# Altium schematic sheet Power_part.SchDoc
size A4; SheetNumber: 3; SheetTotal: 3
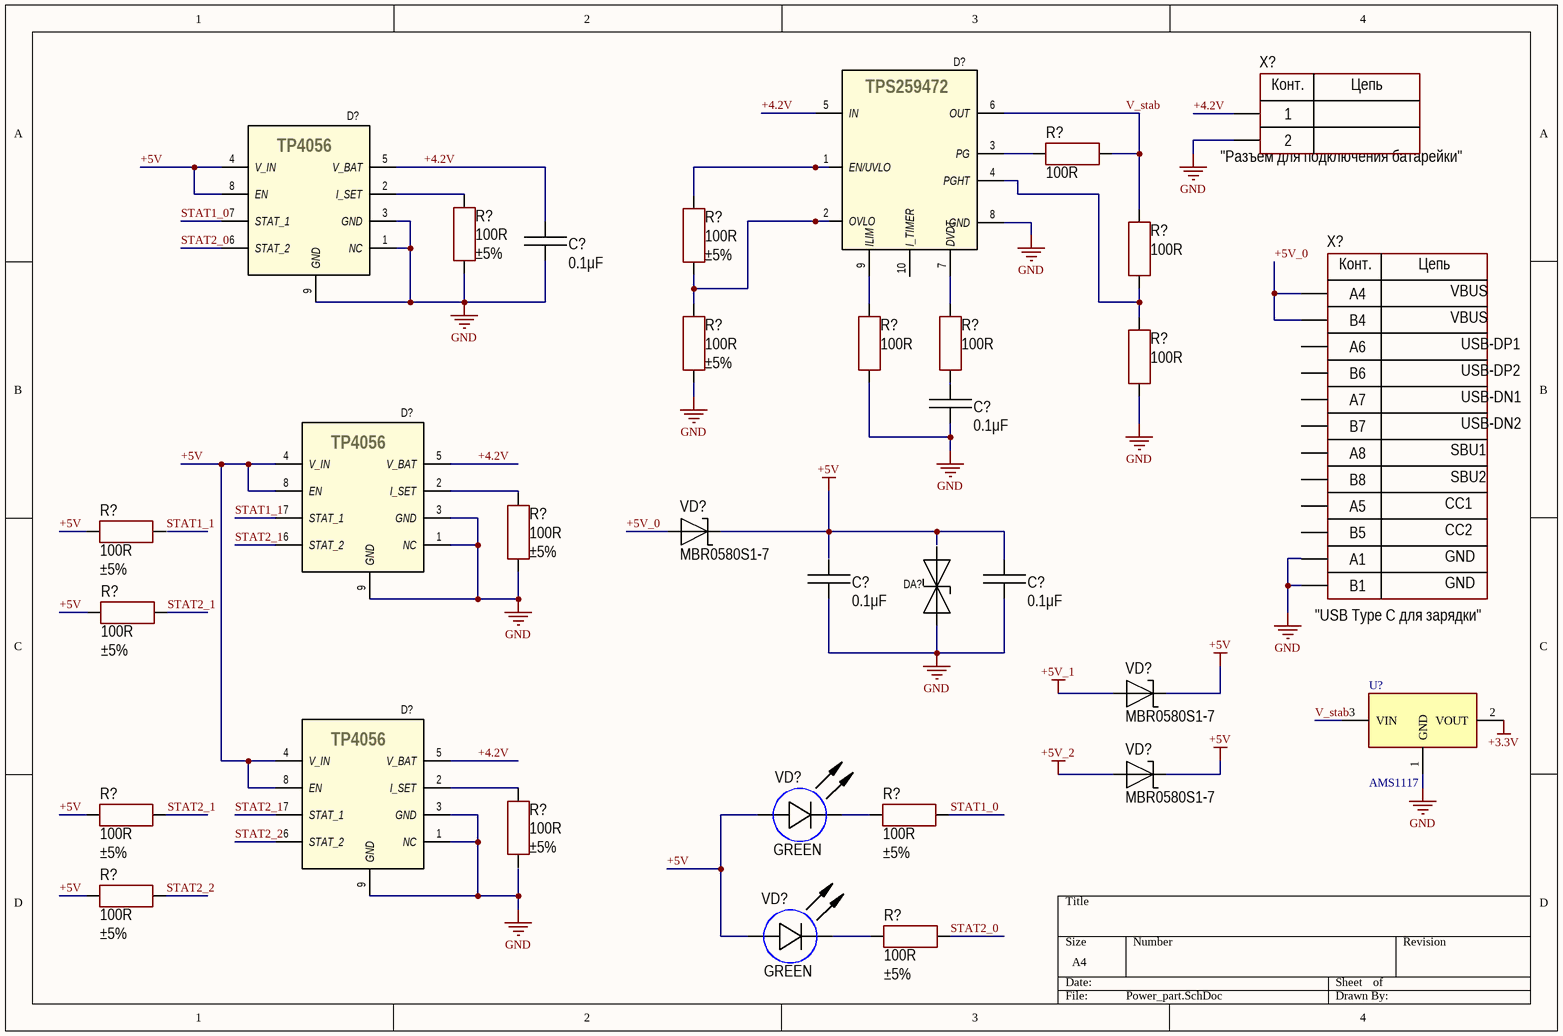
[diagram p0: Power_part.SchDoc]

## Parts
(Parts that share a designator on the sheet are numbered #1, #2 ... from top to bottom, then left to right.)
C?#1  value 0.1μF  [CAP: 0603]
C?#2  value 0.1μF  [CAP: 0603]
C?#3  value 0.1μF  [CAP: 0603]
C?#4  value 0.1μF  [CAP: 0603]
D?#1  Texas Instruments  [TPS259472ARPWR]  (value not drawn)
D?#2  UTD Semiconductor Co.,Ltd  [TP4056]  (value not drawn)
D?#3  UTD Semiconductor Co.,Ltd  [TP4056]  (value not drawn)
D?#4  UTD Semiconductor Co.,Ltd  [TP4056]  (value not drawn)
DA?  Littelfuse  [SMAJ12CA]  (value not drawn)
R?#1  value 100R  [RES: 0603]
R?#2  value 100R  Tolerance: ±5%  [RES: 0603]
R?#3  value 100R  Tolerance: ±5%  [RES: 0603]
R?#4  value 100R  [RES: 0603]
R?#5  value 100R  Tolerance: ±5%  [RES: 0603]
R?#6  value 100R  [RES: 0603]
R?#7  value 100R  [RES: 0603]
R?#8  value 100R  [RES: 0603]
R?#9  value 100R  Tolerance: ±5%  [RES: 0603]
R?#10  value 100R  Tolerance: ±5%  [RES: 0603]
R?#11  value 100R  Tolerance: ±5%  [RES: 0603]
R?#12  value 100R  Tolerance: ±5%  [RES: 0603]
R?#13  value 100R  Tolerance: ±5%  [RES: 0603]
R?#14  value 100R  Tolerance: ±5%  [RES: 0603]
R?#15  value 100R  Tolerance: ±5%  [RES: 0603]
R?#16  value 100R  Tolerance: ±5%  [RES: 0603]
U?  AMS1117  [AMS1117]
VD?#1  PartNumber: MBR0580S1-7  [DIODE: SMA]
VD?#2  PartNumber: MBR0580S1-7  [DIODE: SMA]
VD?#3  PartNumber: MBR0580S1-7  [DIODE: SMA]
VD?#4  Color: GREEN  [LED: 0402B]
VD?#5  Color: GREEN  [LED: 0402B]
X?#1  CommentText: "Разъем для подключения батарейки"  [CON: PLS-2]
X?#2  CommentText: "USB Type C для зарядки"  [CON: TYPE-C-31-M-12]

## Nets
+3.3V: U?.2(VOUT)
+5V: C?#4.2 D?#2.4(V_IN) D?#2.8(EN) D?#3.4(V_IN) D?#3.8(EN) D?#4.4(V_IN) D?#4.8(EN) R?#9.1 R?#11.1 R?#12.1 R?#15.2 VD?#1.2 VD?#2.2 VD?#3.2 VD?#4.1(A) VD?#5.1(A)
+5V_1: VD?#2.1
+5V_2: VD?#3.1
GND: C?#1.2 C?#2.1 C?#3.1 C?#4.1 D?#1.8(GND) D?#2.1(NC) D?#2.3(GND) D?#2.9(GND) D?#3.1(NC) D?#3.3(GND) D?#3.9(GND) D?#4.1(NC) D?#4.3(GND) D?#4.9(GND) DA?.2 R?#2.1 R?#5.1 R?#6.1 R?#8.1 R?#10.1 U?.1(GND) X?#1.2 X?#2.A1 X?#2.B1
+4.2V: C?#1.1 D?#1.5(IN) D?#2.5(V_BAT) D?#3.5(V_BAT) D?#4.5(V_BAT) X?#1.1
+5V_0: VD?#1.1 X?#2.A4 X?#2.B4
STAT1_0: D?#2.7(STAT_1) R?#13.2
STAT1_1: D?#3.7(STAT_1) R?#9.2
STAT2_0: D?#2.6(STAT_2) R?#16.2
STAT2_1: D?#3.6(STAT_2) D?#4.7(STAT_1) R?#11.2 R?#12.2
STAT2_2: D?#4.6(STAT_2) R?#15.1
V_stab: D?#1.6(OUT) R?#1.1 R?#4.2 U?.3(VIN)
NetC?#2_2: C?#2.2 R?#7.1
NetD?#1_1: D?#1.1(EN/UVLO) R?#3.2
NetD?#1_2: D?#1.2(OVLO) R?#3.1 R?#5.2
NetD?#1_3: D?#1.3(PG) R?#1.2
NetD?#1_4: D?#1.4(PGHT) R?#4.1 R?#8.2
NetD?#1_7: D?#1.7(DVDT) R?#7.2
NetD?#1_9: D?#1.9(ILIM) R?#6.2
NetD?#2_2: D?#2.2(I_SET) R?#2.2
NetD?#3_2: D?#3.2(I_SET) R?#10.2
NetD?#4_2: D?#4.2(I_SET) R?#14.2
NetR?#13_1: R?#13.1 VD?#4.2(C)
NetR?#16_1: R?#16.1 VD?#5.2(C)

Not connected (* = marked no-connect by the designer): C?#3 2; D?#1 10(I_TIMER); DA? 1; R?#14 1; X?#2 A5 A6 A7 A8 B5 B6 B7 B8

## Notes on the sheet
- (in symbol Connector_USB_Type_C) Конт.; Цепь; VBUS; USB-DP1; USB-DP2; USB-DN1; USB-DN2; SBU1; SBU2; CC1; CC2; GND
- (in symbol PLS-2) Конт.; Цепь
- (in symbol TPS259472ARPWR) TPS259472

## Library data of the parts
C?#1-C?#4 = Ceramic_0603: Manufacturer: Yageo; PartNumber: CC0603KRX7R7BB104; ValueManufacturerPartNumber: Ceramic capacitor, 0.1μF, X7R, ±10%, 16V, 0603, -55...+125°C; TypeCapacitor: Ceramic capacitor; Tolerance: ±10%; TypeDielectric: X7R; Voltage: 16V; Package: 0603; HelpURL: https://www.digikey.com/product-detail/en/yageo/CC0603KRX7R7BB104/311-1088-1-ND/302998; Temperature: -55...+125°C
D?#1 = TPS259472ARPWR: Hot Swap Voltage Controllers 2.7-V to 23-V 28-mOhm 5.5-A eFuse
D?#2-D?#4 = TP4056: Контроллер заряда Li-Ion аккумуляторов, 1А
DA? = SMAJ12CA: ESD Protection Diodes / TVS Diodes 12V 5uA 20.1 Amps Bi-Directional
R?#1 R?#4 R?#6-R?#8 = Resistor_0603: Manufacturer: Yageo; PartNumber: RC0603JR-07100RL; ValueManufacturerPartNumber: Resistor film, 100R, ±5%, 0603, 0.1W, -55...+125°C; TypeResistor: Resistor film; Power: 0.1W; Tolerance: ±5%; Package: 0603; HelpURL: https://www.digikey.com/product-detail/en/yageo/RC0603JR-07100RL/311-100GRCT-ND/729644; Temperature: -55...+125°C
R?#2 R?#3 R?#5 R?#9-R?#16 = Resistor_0603: Manufacturer: Yageo; PartNumber: RC0603JR-07100RL; ValueManufacturerPartNumber: Resistor film, 100R, ±5%, 0603, 0.1W, -55...+125°C; TypeResistor: Resistor film; Power: 0.1W; Package: 0603; HelpURL: https://www.digikey.com/product-detail/en/yageo/RC0603JR-07100RL/311-100GRCT-ND/729644; Temperature: -55...+125°C
U? = AMS1117: IC REG LINEAR 1A SOT-89-3L; ComponentLink1Description: Datasheet; ComponentLink1URL: http://www.advanced-monolithic.com/pdf/ds1117.pdf; Digikey PN: 4518-AMS1117-3.3CT-ND; JLCPCB PN: C963410
VD?#1-VD?#3 = Schottky_single: Manufacturer: Diodes Incorporated; ValueManufacturerPartNumber: Schottky diode, 80V, 500mA, 1V, 15pF, SOD-123, -55...+150°C; TypeDiode: Schottky diode; Voltage: 80V; Current: 500mA; VoltageDrop: 1V; RecoveryTime: 15pF; Package: SOD-123; HelpURL: https://www.digikey.com/product-detail/en/diodes-incorporated/MBR0580S1-7/MBR0580S1-7DICT-ND/5080371; Temperature: -55...+150°C
VD?#4 VD?#5 = LED_single: ValueManufacturerPartNumber: LED, Green, *, *, *, -55...+150°C; TypeDiode: LED; Manufacturer: *; Package: *; HelpURL: *; Temperature: -55...+150°C; Current: *; VoltageDrop: *; PartNumber: *; ColorParameter: Green
X?#1 = PLS-2: Manufacturer: Connfly; ValueManufacturerPartNumber: Connector, 2pin, 2.54mm, 500VAC, 3A; TypeConnector: Connector; VoltageMax: 500VAC; Pitch: 2.54mm; CurrentMax: 3A; Multichannel: 2pin; HelpURL: https://www.chipdip.ru/product/pls-2; PartNumber: PLS-2
X?#2 = Connector_USB_Type_C: Manufacturer: Korean Hroparts; ValueManufacturerPartNumber: USB Type C, 3A; PartNumber: TYPE-C-31-M-12; TypeConnector: USB Type C; CurrentMax: 3A; HelpURL: https://lcsc.com/product-detail/USB-Type-C_Korean-Hroparts-Elec-TYPE-C-31-M-12_C165948.html